# EAGLE board Tracker_v5B (EAGLE 9.6.2), part 1 of 2
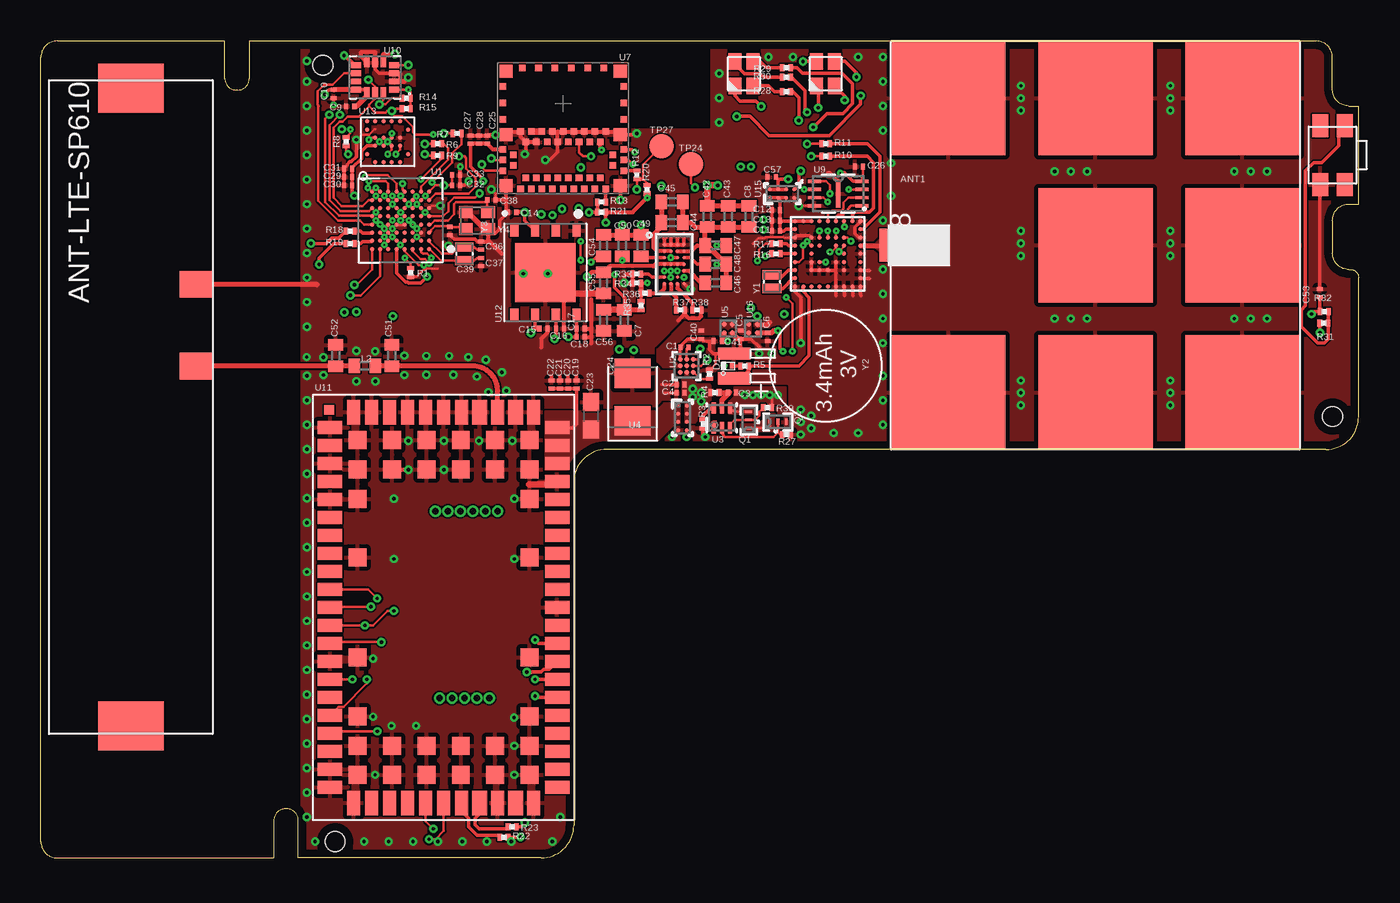
[diagram p8: board, top side]
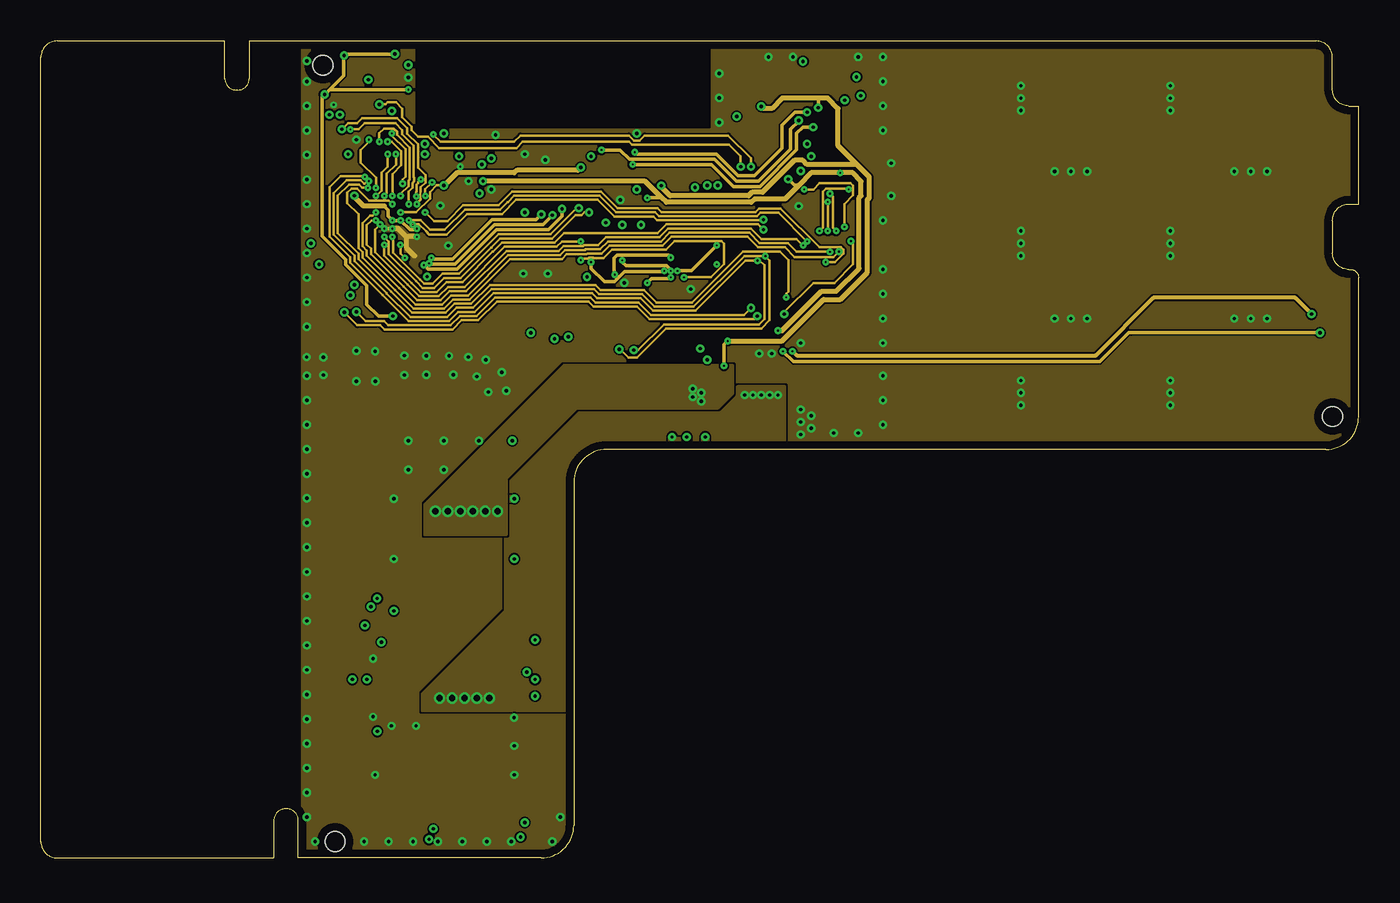
[diagram p9: board, inner layer Route2]
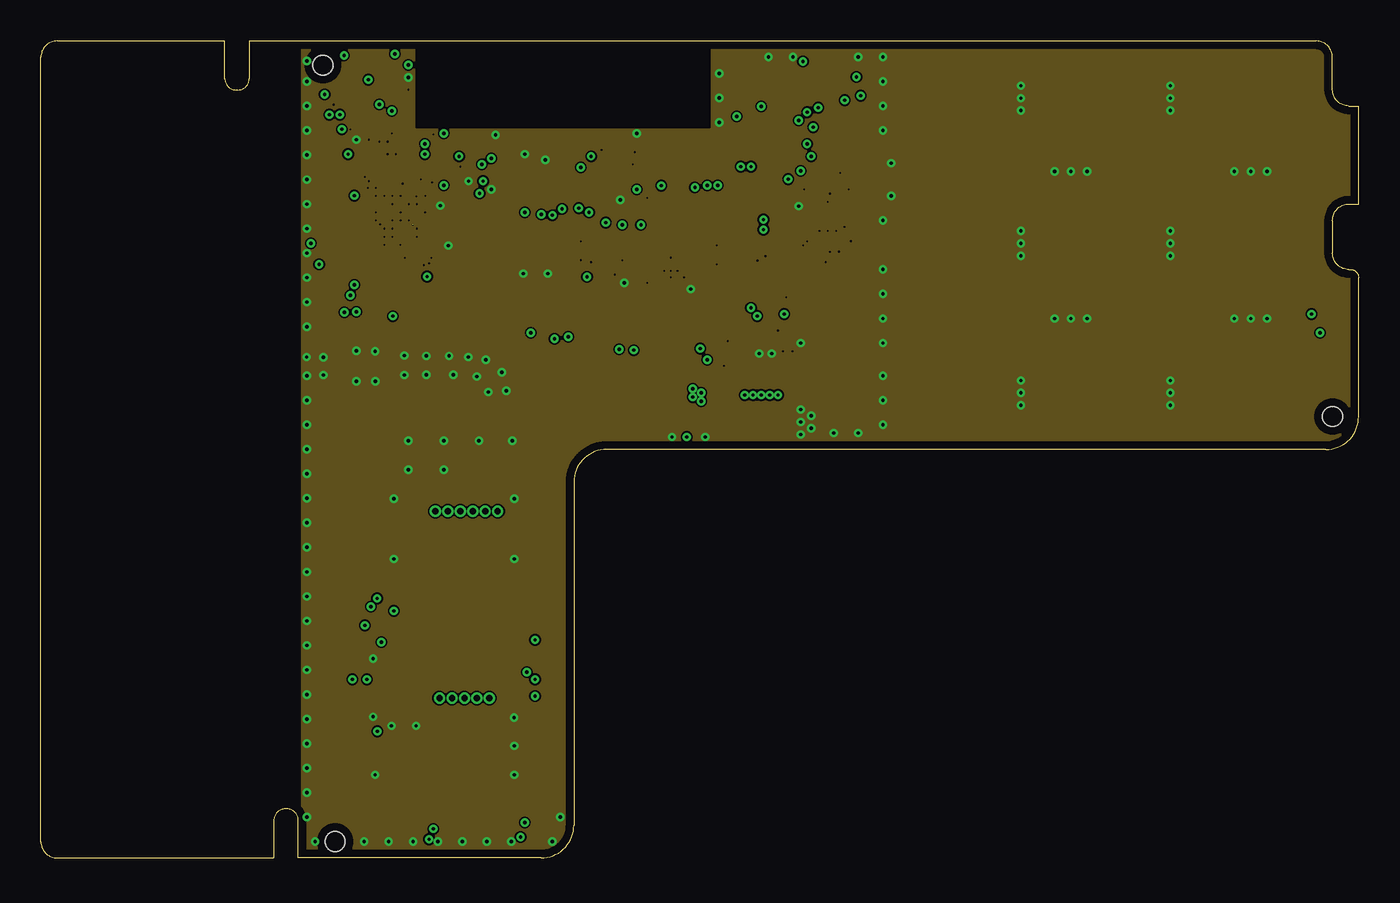
[diagram p10: board, inner layer Route15]
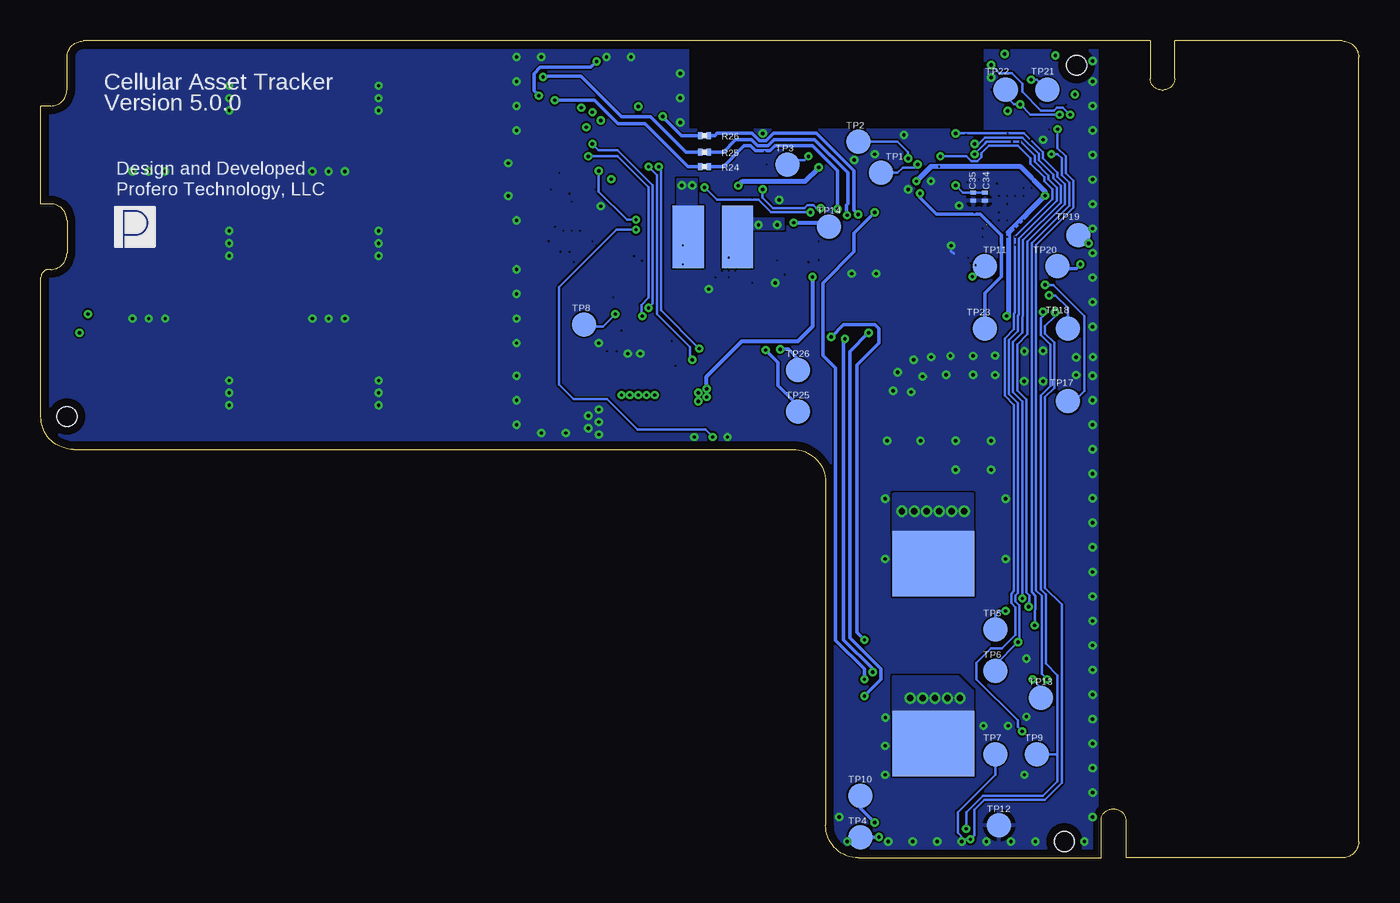
[diagram p11: board, bottom side, seen from below]

Size 80.6 x 49.98 mm. Coordinates in mm from the lower left corner, seen from the top.
Outline: 78.6,24.99 arc90 80.6,26.99 80.6,35.5 arc90 80.1,36 80,36 arc-90 79,37 79,39 arc-90 80,40 80.6,40 80.6,46 80,46 arc-90 79,47 79,48.98 arc90 78,49.98 12.75,49.98 12.75,47.68 arc-90 12.05,46.98 11.95,46.98 arc-90 11.25,47.68 11.25,49.98 1,49.98 arc90 0,48.98 0,1 arc90 1,0 14.25,0 14.25,2.3 arc-90 14.95,3 15.05,3 arc-90 15.75,2.3 15.75,0 30.6,0 arc90 32.6,2 32.6,22.99 arc-90 34.6,24.99 78.6,24.99
Copper layers ([2:1+2*15+16:15]): Top 0.035mm / dielectric 0.2mm / Route2 0.035mm / dielectric 0.26mm / Route15 0.035mm / dielectric 0.2mm / Bottom 0.035mm
Design rules "default *": minimum track width 3mil, minimum drill 8mil, track to track 4mil, track to pad 4mil, pad to pad 4mil, via to via 4mil, smd to smd 4mil, copper to edge 20mil, drill to drill 6mil, minimum pad ring 10mil, minimum via ring 6mil, stop-mask expansion 4mil, vias tented up to drill 16mil, thermal gap 10mil
Net classes: 1 diff: width 0.203 mm, clearance 0.127 mm
Holes 1.2 mm at 79,27 18,1 17.25,48.5
tKeepout: area 78.1,26.1 to 79.9,27.9; area 17.1,0.1 to 18.9,1.9; area 16.3,47.6 to 18.2,49.4

## Footprints (pad centres in the part's own frame; a part is rotated, then mirrored left to right if it is on the bottom)
SGGP.25.2.A.02 = smd 7 x 7: 1 -9,9; 2 0,9; 3 9,9; 4 -9,0; 5 0,0; 6 9,0; 7 -9,-9; 9 9,-9 | smd 2 x 2.5: 8 0,-11.95
C0201 = smd 0.25 x 0.35: 1 -0.25,0; 2 0.25,0
C0402 = smd 0.7 x 0.9: 1 -0.65,0; 2 0.65,0
C0603 = smd 1.1 x 1: 1 -0.85,0; 2 0.85,0
CAPMP3528X210N = smd 1.796 x 2.204: 1 -1.46,0; 2 1.46,0
BAT30F4 = smd 0.25 x 0.35: 1 -0.25,0; 2 0.25,0
CLMVC-FKA = smd 1 x 0.8: B1 -0.75,0.55; B2 0.75,0.55; B3 0.75,-0.55; B4 -0.75,-0.55
PAD_150X75 = smd 3.81 x 1.905: P$1 0,0
PAD_4MMX5MM = smd 4 x 5: P$1 0,0
YJK3 = smd 0.4 x 0.16: 1 0,0; 2 0,-0.5; 3 0,0.5
R0201 = smd 0.28 x 0.43: 1 -0.255,0; 2 0.255,0
EVQ-7PJ/A = smd 1.4 x 1: P$1 -1.8,0.75; P$2 1.8,0.75; P$3 -1.8,-0.75; P$4 1.8,-0.75
TP15R = smd 1.5 x 1.5: TP 0,0
BGA64C50P8X8_500X500X60N = smd 0.28 x 0.28: A1 -1.75,1.75; A2 -1.25,1.75; A3 -0.75,1.75; A4 -0.25,1.75; A5 0.25,1.75; A6 0.75,1.75; A7 1.25,1.75; A8 1.75,1.75; B1 -1.75,1.25; B2 -1.25,1.25; B3 -0.75,1.25; B4 -0.25,1.25; B5 0.25,1.25; B6 0.75,1.25; B7 1.25,1.25; B8 1.75,1.25; C1 -1.75,0.75; C2 -1.25,0.75; C3 -0.75,0.75; C4 -0.25,0.75; C5 0.25,0.75; C6 0.75,0.75; C7 1.25,0.75; C8 1.75,0.75; D1 -1.75,0.25; D2 -1.25,0.25; D3 -0.75,0.25; D4 -0.25,0.25; D5 0.25,0.25; D6 0.75,0.25; D7 1.25,0.25; D8 1.75,0.25; E1 -1.75,-0.25; E2 -1.25,-0.25; E3 -0.75,-0.25; E4 -0.25,-0.25; E5 0.25,-0.25; E6 0.75,-0.25; E7 1.25,-0.25; E8 1.75,-0.25; F1 -1.75,-0.75; F2 -1.25,-0.75; F3 -0.75,-0.75; F4 -0.25,-0.75; F5 0.25,-0.75; F6 0.75,-0.75; F7 1.25,-0.75; F8 1.75,-0.75; G1 -1.75,-1.25; G2 -1.25,-1.25; G3 -0.75,-1.25; G4 -0.25,-1.25; G5 0.25,-1.25; G6 0.75,-1.25; G7 1.25,-1.25; G8 1.75,-1.25; H1 -1.75,-1.75; H2 -1.25,-1.75; H3 -0.75,-1.75; H4 -0.25,-1.75; H5 0.25,-1.75; H6 0.75,-1.75; H7 1.25,-1.75; H8 1.75,-1.75
21-100221A_W91G1+3 = smd 0.305 x 0.305: A1 -0.4,0.4; A2 0,0.4; A3 0.4,0.4; B1 -0.4,0; B2 0,0; B3 0.4,0; C1 -0.4,-0.4; C2 0,-0.4; C3 0.4,-0.4
DSE0006A = smd 0.66 x 0.25: 1 -0.62,0.5 | smd 0.7 x 0.25: 2 -0.6,0; 3 -0.6,-0.5; 4 0.6,-0.5; 5 0.6,0; 6 0.6,0.5
YZP0008ADCD = smd 0.23 x 0.23: A1 -0.25,0.75; A2 0.25,0.75; B1 -0.25,0.25; B2 0.25,0.25; C1 -0.25,-0.25; C2 0.25,-0.25; D1 -0.25,-0.75; D2 0.25,-0.75
CB_4_1 = smd 0.305 x 0.305: A1 -0.25,-0.25; A2 0.25,-0.25; B1 -0.25,0.25; B2 0.25,0.25
ISP1507-AL = smd 0.8 x 0.8: 1 0.5,-0.5; 7 0.5,-3.6; 25 7.5,-3.6; 31 7.5,-0.5; 52 0.5,-7.5; 59 7.5,-7.5 | smd 0.4 x 0.4: 2 0.3,-1.4; 3 0.95,-1.725; 4 0.3,-2.05; 5 0.95,-2.375; 6 0.3,-2.7; 8 1.4,-3.8; 9 1.725,-3.15; 10 2.05,-3.8; 11 2.375,-3.15; 12 2.7,-3.8; 13 3.025,-3.15; 14 3.35,-3.8; 15 3.675,-3.15; 16 4,-3.8; 17 4.325,-3.15; 18 4.65,-3.8; 19 4.975,-3.15; 20 5.3,-3.8; 21 5.625,-3.15; 22 5.95,-3.8; 23 6.275,-3.15; 24 6.6,-3.8; 26 7.7,-2.7; 27 7.05,-2.375; 28 7.7,-2.05; 29 7.05,-1.725; 30 7.7,-1.4; 32 6.6,-0.3; 33 6.275,-0.95; 34 5.95,-0.3; 35 5.625,-0.95; 36 5.3,-0.3; 37 4.975,-0.95; 38 4.65,-0.3; 39 4.325,-0.95; 40 4,-0.3; 41 3.675,-0.95; 42 3.35,-0.3; 43 3.025,-0.95; 44 2.7,-0.3; 45 2.375,-0.95; 46 2.05,-0.3; 47 1.725,-0.95; 48 1.4,-0.3; 49 0.3,-4.55; 50 0.3,-5.55; 51 0.3,-6.55; 53 1.5,-7.7; 54 2.5,-7.7; 55 3.5,-7.7; 56 4.5,-7.7; 57 5.5,-7.7; 58 6.5,-7.7; 60 7.7,-6.55; 61 7.7,-5.55; 62 7.7,-4.55
ZOE-M8 = smd 0.27 x 0.27: P$2E1 -2,0; P$A1 -2,2; P$A2 -1.5,2; P$A3 -1,2; P$A4 -0.5,2; P$A5 0,2; P$A6 0.5,2; P$A7 1,2; P$A8 1.5,2; P$A9 2,2; P$B1 -2,1.5; P$B9 2,1.5; P$C1 -2,1; P$C3 -1,1; P$C4 -0.5,1; P$C5 0,1; P$C6 0.5,1; P$C7 1,1; P$C9 2,1; P$D1 -2,0.5; P$D3 -1,0.5; P$D4 -0.5,0.5; P$D6 0.5,0.5; P$D9 2,0.5; P$E3 -1,0; P$E7 1,0; P$E9 2,0; P$F1 -2,-0.5; P$F3 -1,-0.5; P$F4 -0.5,-0.5; P$F6 0.5,-0.5; P$F7 1,-0.5; P$F9 2,-0.5; P$G1 -2,-1; P$G3 -1,-1; P$G4 -0.5,-1; P$G5 0,-1; P$G6 0.5,-1; P$G7 1,-1; P$G9 2,-1; P$H1 -2,-1.5; P$H9 2,-1.5; P$J1 -2,-2; P$J2 -1.5,-2; P$J3 -1,-2; P$J4 -0.5,-2; P$J5 0,-2; P$J6 0.5,-2; P$J7 1,-2; P$J8 1.5,-2; P$J9 2,-2
USON-8L-2X3X0P6_MAC = smd 0.813 x 0.203: 1 -1.448,0.75; 2 -1.448,0.25; 3 -1.448,-0.25; 4 -1.448,-0.75; 5 1.448,-0.75; 6 1.448,-0.25; 7 1.448,0.25; 8 1.448,0.75 | smd 0.305 x 1.702: 9 0,0
PQFN50P300X250X86-14N = smd 0.6 x 0.35: 1 -1.16,0.75; 2 -1.16,0.25; 3 -1.16,-0.25; 4 -1.16,-0.75; 8 1.16,-0.75; 9 1.16,-0.25; 10 1.16,0.25; 11 1.16,0.75 | smd 0.35 x 0.6: 5 -0.5,-0.91; 6 0,-0.91; 7 0.5,-0.91; 12 0.5,0.91; 13 0,0.91; 14 -0.5,0.91
SARA-R4 = smd 1.5 x 0.8: 1 1.05,-2; 2 1.05,-3.1; 3 1.05,-4.2; 4 1.05,-5.3; 5 1.05,-6.4; 6 1.05,-7.5; 7 1.05,-8.6; 8 1.05,-9.7; 9 1.05,-10.8; 10 1.05,-11.9; 11 1.05,-13; 12 1.05,-14.1; 13 1.05,-15.2; 14 1.05,-16.3; 15 1.05,-17.4; 16 1.05,-18.5; 17 1.05,-19.6; 18 1.05,-20.7; 19 1.05,-21.8; 20 1.05,-22.9; 21 1.05,-24; 33 14.95,-24; 34 14.95,-22.9; 35 14.95,-21.8; 36 14.95,-20.7; 37 14.95,-19.6; 38 14.95,-18.5; 39 14.95,-17.4; 40 14.95,-16.3; 41 14.95,-15.2; 42 14.95,-14.1; 43 14.95,-13; 44 14.95,-11.9; 45 14.95,-10.8; 46 14.95,-9.7; 47 14.95,-8.6; 48 14.95,-7.5; 49 14.95,-6.4; 50 14.95,-5.3; 51 14.95,-4.2; 52 14.95,-3.1; 53 14.95,-2 | smd 0.8 x 1.5: 22 2.5,-24.95; 23 3.6,-24.95; 24 4.7,-24.95; 25 5.8,-24.95; 26 6.9,-24.95; 27 8,-24.95; 28 9.1,-24.95; 30 11.3,-24.95; 32 13.5,-24.95; 54 13.5,-1.05; 56 11.3,-1.05; 58 9.1,-1.05; 59 8,-1.05; 60 6.9,-1.05; 61 5.8,-1.05; 62 4.7,-1.05; 63 3.6,-1.05; 64 2.5,-1.05 | smd 0.9 x 1.5: 29 10.2,-24.95; 31 12.4,-24.95; 55 12.4,-1.05; 57 10.2,-1.05 | smd 1.1 x 1.1: 65 2.75,-2.75; 66 4.85,-2.75; 67 6.95,-2.75; 68 9.05,-2.75; 69 11.15,-2.75; 70 13.25,-2.75; 71 2.75,-4.55; 72 4.85,-4.55; 73 6.95,-4.55; 74 9.05,-4.55; 75 11.15,-4.55; 76 13.25,-4.55; 77 2.75,-6.35; 78 13.25,-6.35; 79 2.75,-9.95; 80 13.25,-9.95; 81 2.75,-16.05; 82 13.25,-16.05; 83 2.75,-19.65; 84 13.25,-19.65; 85 2.75,-21.45; 86 4.85,-21.45; 87 6.95,-21.45; 88 9.05,-21.45; 89 11.15,-21.45; 90 13.25,-21.45; 91 2.75,-23.25; 92 4.85,-23.25; 93 6.95,-23.25; 94 9.05,-23.25; 95 11.15,-23.25; 96 13.25,-23.25 | smd 0.6 x 0.6: P$1 1,-0.9
PSON127P500X600X82-9N = smd 0.71 x 0.51: 1 -2.55,1.905; 2 -2.55,0.635; 3 -2.55,-0.635; 4 -2.55,-1.905; 5 2.55,-1.905; 6 2.55,-0.635; 7 2.55,0.635; 8 2.55,1.905 | smd 3.6 x 3.7: 9 0,0
21-WLCSP = smd 0.275 x 0.275: A2 -0.75,1.25; A5 0.75,1.25; A6 1.25,1.25; B1 -1.25,0.75; B3 -0.25,0.75; B4 0.25,0.75; B6 1.25,0.75; C1 -1.25,0.25; C3 -0.25,0.25; C4 0.25,0.25; C6 1.25,0.25; D1 -1.25,-0.25; D3 -0.25,-0.25; D4 0.25,-0.25; D6 1.25,-0.25; E1 -1.25,-0.75; E3 -0.25,-0.75; E4 0.25,-0.75; E6 1.25,-0.75; F2 -0.75,-1.25; F5 0.75,-1.25
YFP28 = smd 0.229 x 0.229: A1 -0.6,1.2; A2 -0.2,1.2; A3 0.2,1.2; A4 0.6,1.2; B1 -0.6,0.8; B2 -0.2,0.8; B3 0.2,0.8; B4 0.6,0.8; C1 -0.6,0.4; C2 -0.2,0.4; C3 0.2,0.4; C4 0.6,0.4; D1 -0.6,0; D2 -0.2,0; D3 0.2,0; D4 0.6,0; E1 -0.6,-0.4; E2 -0.2,-0.4; E3 0.2,-0.4; E4 0.6,-0.4; F1 -0.6,-0.8; F2 -0.2,-0.8; F3 0.2,-0.8; F4 0.6,-0.8; G1 -0.6,-1.2; G2 -0.2,-1.2; G3 0.2,-1.2; G4 0.6,-1.2
ANT-LTE-SP610-T = smd 1.65 x 2: 1 2.5,-4; 2 7.5,-4 | smd 3 x 4: 3 -19.5,0; 4 19.5,0
ECS-.327-12.5-1210-TR = smd 0.575 x 1.14: 1 -0.412,0; 2 0.412,0
ML614-TZ21 = smd 0.75 x 2: 1 0.75,1; 2 -0.75,1
XTAL_ECS-160-9-37-CKM-TR = smd 0.85 x 0.75: 1 -0.675,-0.525; 2 0.675,-0.525; 3 0.675,0.525; 4 -0.675,0.525

## Placement (x,y rotation side)
ANT1  SGGP.25.2.A.02  [SGGP.25.2.A.02]  64.5,37.48 270 top
C1  0.47uF  [C0201]  39.37,31.24 180 top
C2  0.1uF  [C0201]  39.12,28.96 180 top
C3  0.1uF  [C0201]  42.27,28.47 0 top
C4  1uF  [C0201]  39.12,28.45 180 top
C5  1uF  [C0201]  42.8,32 270 top
C6  1uF  [C0201]  44.45,31.88 270 top
C7  10uF  [C0402]  35.69,32.89 270 top
C8  68nF  [C0402]  43.31,39.24 90 top
C9  0.1uF  [C0201]  18.92,45.97 180 top
C10  0.1uF  [C0201]  17.91,46.74 270 top
C11  0.1uF  [C0201]  44.96,38.35 180 top
C12  1uF  [C0201]  44.96,39.62 180 top
C13  10000pF  [C0201]  44.96,38.99 180 top
C14  47pF  [C0201]  28.83,39.5 180 top
C15  47pF  [C0201]  30.73,32.38 0 top
C16  47pF  [C0201]  31.75,32.38 0 top
C17  0.1uF  [C0201]  33.02,32.38 0 top
C18  47pF  [C0201]  33.02,31.88 0 top
C19  15pF  [C0201]  32.77,28.96 90 top
C20  68pF  [C0201]  32.26,28.96 90 top
C21  10000pF  [C0201]  31.75,28.96 90 top
C22  0.1uF  [C0201]  31.24,28.96 90 top
C23  10uF  [C0603]  33.66,27.05 90 top
C24  TAJB476M010TNJ  [CAPMP3528X210N]  36.2,28.19 90 top
C25  0.1uF  [C0201]  27.3,43.94 90 top
C26  0.1uF  [C0201]  50.04,42.29 180 top
C27  0.1uF  [C0201]  26.29,43.94 90 top
C28  1uF  [C0201]  26.8,43.94 90 top
C29  10000pF  [C0201]  18.8,41.66 180 top
C30  10000pF  [C0201]  18.8,41.15 180 top
C31  10000pF  [C0201]  18.8,42.16 180 top
C32  0.1uF  [C0201]  25.4,41.15 0 top
C33  10000pF  [C0201]  25.4,41.78 0 top
C34  0.1uF  [C0201]  22.86,40.46 270 bottom
C35  10000pF  [C0201]  23.57,40.46 270 bottom
C36  15pF  [C0201]  26.92,37.47 90 top
C37  15pF  [C0201]  26.92,36.45 270 top
C38  10pF  [C0201]  27.56,40.26 0 top
C39  10pF  [C0201]  25.02,38.35 270 top
C40  1uF  [C0201]  40.39,32 270 top
C41  1uF  [C0201]  41.4,31.62 180 top
C42  68nF  [C0402]  40.77,39.24 90 top
C43  47nF  [C0402]  42.04,39.24 90 top
C44  100pF  [C0402]  38.61,38.86 0 top
C45  1.8nF  [C0402]  38.61,40.13 0 top
C46  22nF  [C0402]  41.27,35.18 0 top
C47  470nF  [C0402]  41.27,37.47 180 top
C48  10nF  [C0402]  41.27,36.32 0 top
C49  10nF  [C0402]  36.7,37.47 90 top
C50  470nF  [C0402]  35.56,37.47 90 top
C51  dnp  [C0402]  21.46,30.73 90 top
C52  dnp  [C0402]  18.03,30.73 90 top
C53  100pF  [C0201]  78.22,34.55 90 top
C54  22nF  [C0402]  34.42,37.47 90 top
C55  2.2uF  [C0402]  34.42,35.18 90 top
C56  2.2uF  [C0402]  34.42,32.89 270 top
C57  1uF  [C0201]  44.7,41.66 180 top
D1  BAT30F4  [BAT30F4]  42.04,30.1 180 top
D2  CLMVC-FKA  [CLMVC-FKA]  48,47.98 90 top
D6  CLMVC-FKA  [CLMVC-FKA]  43,47.98 90 top
J1  SMD_PADPAD_150X75  [PAD_150X75]  41,38 270 bottom
J3  SMD_PADPAD_150X75  [PAD_150X75]  38,38 270 bottom
J6  SMD_PADPAD_4MMX5MM  [PAD_4MMX5MM]  26,18 270 bottom
J7  SMD_PADPAD_4MMX5MM  [PAD_4MMX5MM]  26,7 270 bottom
L2  0ohm  [C0402]  19.81,30.1 180 top
Q1  CSD13385F5T  [YJK3]  43.31,26.8 180 top
Q2  CSD13385F5T  [YJK3]  45.09,26.67 90 top
R1  100k  [R0201]  22.61,35.81 270 top
R2  10k  [R0201]  40.89,29.59 270 top
R3  2k  [R0201]  40.51,26.54 90 top
R4  330  [R0201]  41.22,28.47 180 top
R5  1k  [R0201]  43.05,30.1 0 top
R6  100  [R0201]  24.26,43.69 180 top
R7  100  [R0201]  25.46,44.32 180 top
R8  100  [R0201]  18.67,43.81 270 top
R9  100  [R0201]  24.26,42.98 180 top
R10  dnp  [R0201]  48.01,42.93 0 top
R11  dnp  [R0201]  48.01,43.69 0 top
R12  100  [R0201]  36.45,41.78 90 top
R13  100  [R0201]  34.29,40.13 0 top
R14  4.7k  [R0201]  22.35,46.48 180 top
R15  4.7k  [R0201]  22.35,45.85 180 top
R16  100  [R0201]  44.96,36.96 180 top
R17  100  [R0201]  44.96,37.59 180 top
R18  29  [R0201]  18.92,38.35 0 top
R19  29  [R0201]  18.92,37.59 0 top
R20  dnp  [R0201]  37.08,40.89 90 top
R21  dnp  [R0201]  34.29,39.5 180 top
R22  29  [R0201]  28.32,1.27 180 top
R23  29  [R0201]  28.83,1.91 180 top
R24  130  [R0201]  40.01,42.29 0 bottom
R25  30  [R0201]  40.01,43.18 0 bottom
R26  30  [R0201]  40.01,44.2 0 bottom
R27  5M  [R0201]  45.59,25.91 180 top
R28  130  [R0201]  45.59,46.86 0 top
R29  30  [R0201]  45.61,48.34 0 top
R30  30  [R0201]  45.59,47.75 0 top
R31  100k  [R0201]  78.48,32.72 180 top
R32  100k  [R0201]  78.49,33.43 0 top
R33  10k  [R0201]  36.45,35.73 180 top
R34  196ohm  [R0201]  36.45,35.18 180 top
R35  20k  [R0201]  36.7,33.78 90 top
R36  845ohm  [R0201]  36.96,34.54 180 top
R37  10k  [R0201]  39.12,33.53 180 top
R38  2.4k  [R0201]  40.13,33.53 180 top
R39  5M  [R0201]  44.45,27.56 180 top
S1  EVQ-7PJ  [EVQ-7PJ/A]  79,43 90 top
TP1  TPTP15R  [TP15R]  29.21,41.91 0 bottom
TP2  TPTP15R  [TP15R]  30.61,43.81 0 bottom
TP3  TPTP15R  [TP15R]  34.92,42.42 0 bottom
TP4  TPTP15R  [TP15R]  30.48,1.27 0 bottom
TP5  TPTP15R  [TP15R]  22.23,13.97 0 bottom
TP6  TPTP15R  [TP15R]  22.23,11.43 0 bottom
TP7  TPTP15R  [TP15R]  22.23,6.35 0 bottom
TP8  TPTP15R  [TP15R]  47.37,32.64 0 bottom
TP9  TPTP15R  [TP15R]  19.68,6.35 0 bottom
TP10  TPTP15R  [TP15R]  30.48,3.81 0 bottom
TP11  TPTP15R  [TP15R]  22.86,36.2 0 bottom
TP12  TPTP15R  [TP15R]  22,2 0 bottom
TP13  TPTP15R  [TP15R]  19.43,9.78 0 bottom
TP14  TPTP15R  [TP15R]  32.38,38.61 0 bottom
TP17  TPTP15R  [TP15R]  17.78,27.94 0 bottom
TP18  TPTP15R  [TP15R]  17.78,32.38 0 bottom
TP19  TPTP15R  [TP15R]  17.14,38.1 0 bottom
TP20  TPTP15R  [TP15R]  18.41,36.2 0 bottom
TP21  TPTP15R  [TP15R]  19.05,46.99 0 bottom
TP22  TPTP15R  [TP15R]  21.59,46.99 0 bottom
TP23  TPTP15R  [TP15R]  22.86,32.38 0 bottom
TP24  TPTP15R  [TP15R]  39.75,42.43 0 top
TP25  TPTP15R  [TP15R]  34.29,27.3 0 bottom
TP26  TPTP15R  [TP15R]  34.29,29.84 0 bottom
TP27  TPTP15R  [TP15R]  37.97,43.53 0 top
U1  STM32L412RBI6  [BGA64C50P8X8_500X500X60N]  22,39 180 top
U2  MAX17262REWL+T  [21-100221A_W91G1+3]  39.5,30.1 180 top
U3  BQ29700DSER  [DSE0006A]  41.66,26.92 90 top
U4  TPS22970YZPR  [YZP0008ADCD]  39.24,26.92 0 top
U5  ADP165ACBZ-3.3-R7  [CB_4_1]  42.04,32.38 270 top
U7  ISP1507ALISP1507AL_ISP1507-AL  [ISP1507-AL]  35.94,40.64 180 top
U8  ZOE-M8B  [ZOE-M8]  48.13,36.96 270 top
U9  MX25R1635FZUIL0  [USON-8L-2X3X0P6_MAC]  48.77,40.64 0 top
U10  LSM6DSMTR  [PQFN50P300X250X86-14N]  20.45,47.75 180 top
U11  SARA-R4  [SARA-R4]  16.64,28.32 0 top
U12  SIM-ST-MFF2  [PSON127P500X600X82-9N]  30.86,35.81 270 top
U13  AT25QL128A-UUE-T  [21-WLCSP]  21.21,43.81 90 top
U14  BQ51050BDSBGA  [YFP28]  38.73,36.32 0 top
U15  TPS22970YZPR  [YZP0008ADCD]  45.34,40.64 90 top
U16  ADP165ACBZ-1.8-R7  [CB_4_1]  43.56,32.38 0 top
U$1  ANT-LTE-SP610-T  [ANT-LTE-SP610-T]  5.5,27.59 90 top
U$2  [PROFERO-LOGO-SMALL]  76.12,37.34 0 bottom
Y1  ECS-.327-12.5-1210-TR  [ECS-.327-12.5-1210-TR]  44.72,35.25 90 top
Y2  ML614-TZ21  [ML614-TZ21]  41.4,30.1 270 top
Y3  ECS-.327-12.5-1210-TR  [ECS-.327-12.5-1210-TR]  25.91,36.96 270 top
Y4  ECS-160-9-37-CKM-TR  [XTAL_ECS-160-9-37-CKM-TR]  26.67,38.99 180 top